# EAGLE board e-ink-display-v020 (EAGLE 9.4.2)
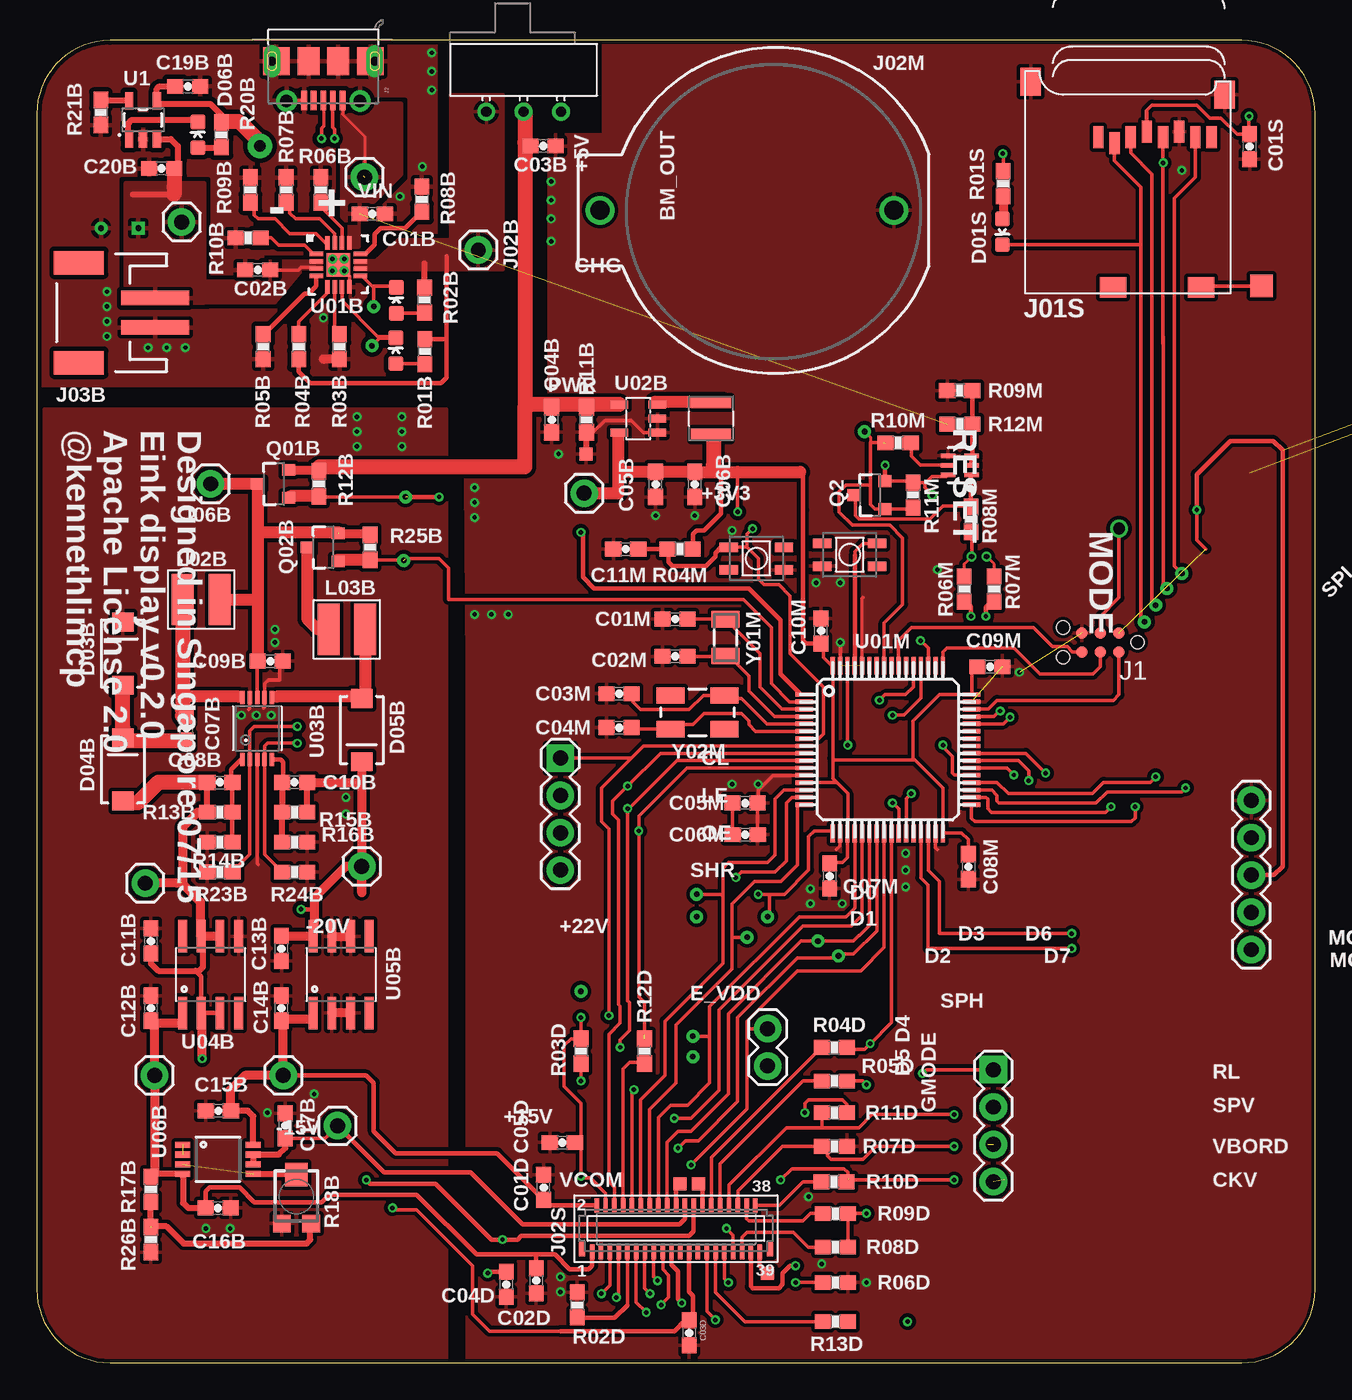
[diagram p5: board, top side]
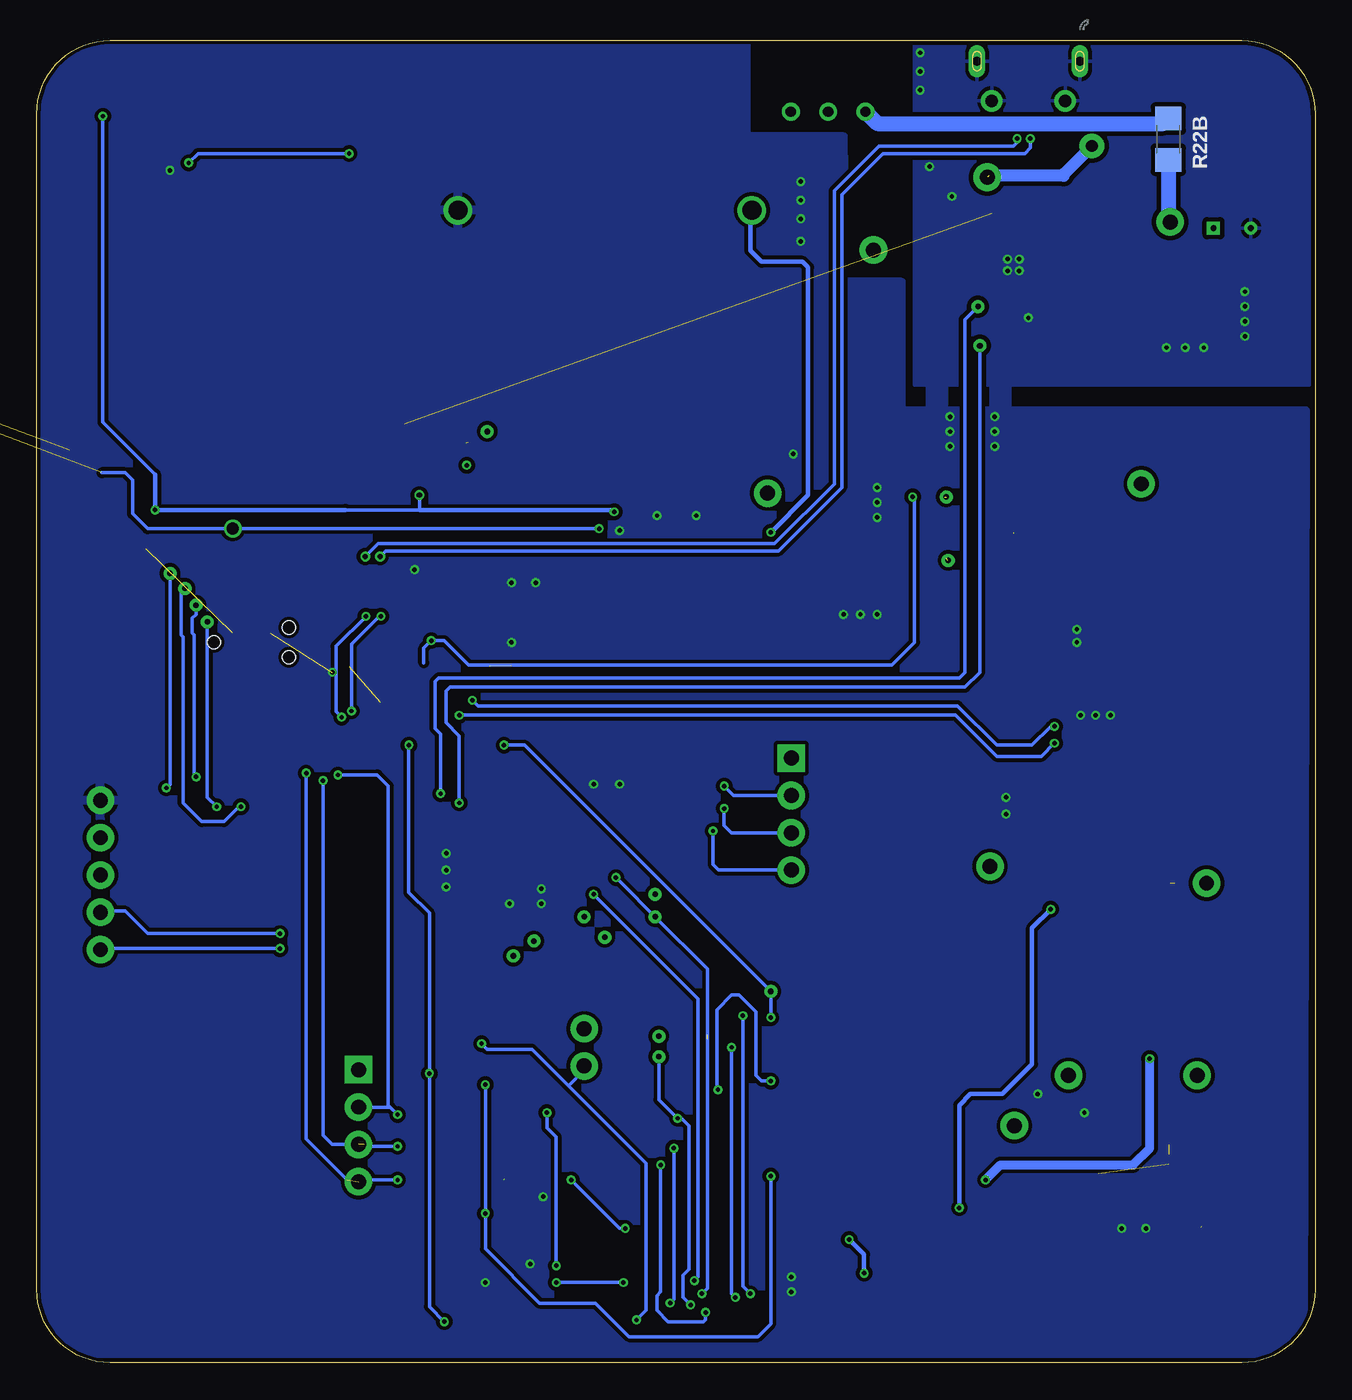
[diagram p6: board, bottom side, seen from below]

Size 87 x 90 mm. Coordinates in mm from the lower left corner, seen from the top.
Outline: 5,0 82,0 arc90 87,5 87,85 arc90 82,90 5,90 arc90 0,85 0,5 arc90 5,0
Copper layers (1*16): Top 0.035mm / dielectric 1.5mm / Bottom 0.035mm
Design rules "dirt_cheap_dirty_boards.v1": minimum track width 5mil, minimum drill 0.3mm, track to track 6mil, track to pad 6mil, pad to pad 6mil, via to via 6mil, smd to smd 0mil, copper to edge 10mil, drill to drill 10mil, minimum pad ring 10mil, minimum via ring 6mil, stop-mask expansion 2mil, vias tented up to drill 25mil, thermal gap 10mil
Net classes: 0 default: width 0.203 mm

## Footprints (pad centres in the part's own frame; a part is rotated, then mirrored left to right if it is on the bottom)
TP-SQ_15TH = drill 0.381 pad 0.61 square: P$1 0,0
TP-RD_15TH = drill 0.381 pad 0.61: P$1 0,0
0603-CAP = smd 1.1 x 1: 1 -0.85,0; 2 0.85,0
LED-0603 = smd 1 x 1: A 0,-0.877; C 0,0.877
SMA-DIODE = smd 1.27 x 1.47: A -2.15,0; C 2.15,0
TC2030-MCP-NL = smd 0.787 x 0.787: 1 1.27,-0.635; 2 1.27,0.635; 3 2.54,-0.635; 4 2.54,0.635; 5 3.81,-0.635; 6 3.81,0.635 | hole 0.889: 0,0; 5.08,-1.016; 5.08,1.016
1X01 = drill 1.016 pad 1.88: 1 0,0
MICROSD = smd 0.7 x 1.5: 1 9,-10.64; 2 7.9,-10.24; 3 6.8,-10.64; 4 5.7,-11.04; 5 4.6,-10.64; 6 3.5,-11.04; 7 2.4,-10.64; 8 1.3,-10.64 | smd 1.8 x 1.4: CD1 2,-0.44; CD2 8,-0.44 | smd 1.4 x 1.9: MT1 0.4,-13.54; MT2 13.6,-14.44
MOLEX_105017-0001 = smd 0.4 x 1.35: 1 -1.3,2.675; 2 -0.65,2.675; 3 0,2.675; 4 0.65,2.675; 5 1.3,2.675 | drill 0.6 pad 0.8 long: MH1 -3.5,0; MH2 3.5,0 | drill 0.85 pad 1.45: MH3 2.5,2.7; MH4 -2.5,2.7 | smd 1.5 x 1.9: P$8 -1,0; P$9 1,0 | smd 1.8 x 1.9: P$10 -3.2,0; P$11 3.2,0
BATTCOM_20MM_PTH = drill 1.3: 1 11.85,0; 2 -8.15,0
FPC-0.3-39 = smd 0.3 x 1: 1 -1.2,-1.45; 2 -0.89,1.7; 3 -0.6,-1.45; 4 -0.29,1.7; 5 0,-1.45; 6 0.31,1.7; 7 0.6,-1.45; 8 0.91,1.7; 9 1.2,-1.45; 10 1.51,1.7; 11 1.8,-1.45; 12 2.11,1.7; 13 2.4,-1.45; 14 2.71,1.7; 15 3,-1.45; 16 3.31,1.7; 17 3.6,-1.45; 18 3.91,1.7; 19 4.2,-1.45; 20 4.51,1.7; 21 4.8,-1.45; 22 5.11,1.7; 23 5.4,-1.45; 24 5.71,1.7; 25 6,-1.45; 26 6.31,1.7; 27 6.6,-1.45; 28 6.91,1.7; 29 7.2,-1.45; 30 7.51,1.7; 31 7.8,-1.45; 32 8.11,1.7; 33 8.4,-1.45; 34 8.71,1.7; 35 9,-1.45; 36 9.31,1.7; 37 9.6,-1.45; 38 9.91,1.7; 39 10.2,-1.45 | smd 0.4 x 1: H1 -1.9,-1.25; H2 10.9,-1.25
JST-2-SMD = smd 1 x 4.6: 1 -1,-3.7; 2 1,-3.7 | smd 1.6 x 3.4: NC1 -3.4,1.5; NC2 3.4,1.5
1X05 = drill 1.016 pad 1.88: 1 0,0; 2 2.54,0; 3 5.08,0; 4 7.62,0; 5 10.16,0
1X04 = drill 1.016 pad 1.88 square: 1 0,0 | drill 1.016 pad 1.88: 2 2.54,0; 3 5.08,0; 4 7.62,0
1X02 = drill 1.016 pad 1.88: 1 0,0; 2 2.54,0
INDUCTOR-NR3015 = smd 0.8 x 2.7: 1 -1.1,0; 2 1.1,0
4040(1515) = smd 1.5 x 3.5: P$1 1.25,0; P$2 -1.25,0
SOT23-3 = smd 0.8 x 0.9: 1 -0.95,-1; 2 0.95,-1; 3 0,1.1
SOT363 = smd 0.3 x 0.99: 1 -0.65,-0.8; 2 0,-0.8; 3 0.65,-0.8; 4 0.65,0.81; 5 0,0.81; 6 -0.65,0.81
0603-RES = smd 1.1 x 1: 1 -0.85,0; 2 0.85,0
TC33X = smd 1.2 x 1.2: 1 -1,-1.825; 3 1,-1.825 | smd 1.5 x 1.6: 2 0,1.5
1206 = smd 1.6 x 1.8: 1 -1.4,0; 2 1.4,0
R0603 = smd 1 x 1.1: 1 -0.85,0; 2 0.85,0
TACTILE_SWITCH_SMD = smd 1.25 x 0.65: 1 -1.875,0.775; 2 1.875,0.775; 3 -1.875,-0.775; 4 1.875,-0.775
SW-SPDT-TH = drill 0.7: 1 0,0; 2 -2.54,0; 3 2.54,0
TP35_BOT = smd 0.889 x 0.889 bottom: P$1 0,0
TP_15TH = drill 0.381 pad 0.61: P$1 0,0
SOT23-5 = smd 0.55 x 1.2: 1 -0.95,-1.3; 2 0,-1.3; 3 0.95,-1.3; 4 0.95,1.3; 5 -0.95,1.3
PVQFN-16 = smd 0.9 x 0.3: 1 -1.5,0.75; 2 -1.5,0.25; 3 -1.5,-0.25; 4 -1.5,-0.75; 9 1.5,-0.75; 10 1.5,-0.25; 11 1.5,0.25; 12 1.5,0.75 | smd 0.3 x 0.9: 5 -0.75,-1.5; 6 -0.25,-1.5; 7 0.25,-1.5; 8 0.75,-1.5; 13 0.75,1.5; 14 0.25,1.5; 15 -0.25,1.5; 16 -0.75,1.5 | smd 1.6 x 1.6: EXP 0,0
TQFP64 = smd 1.2 x 0.3: 1 -5.7,3.75; 2 -5.7,3.25; 3 -5.7,2.75; 4 -5.7,2.25; 5 -5.7,1.75; 6 -5.7,1.25; 7 -5.7,0.75; 8 -5.7,0.25; 9 -5.7,-0.25; 10 -5.7,-0.75; 11 -5.7,-1.25; 12 -5.7,-1.75; 13 -5.7,-2.25; 14 -5.7,-2.75; 15 -5.7,-3.25; 16 -5.7,-3.75; 33 5.7,-3.75; 34 5.7,-3.25; 35 5.7,-2.75; 36 5.7,-2.25; 37 5.7,-1.75; 38 5.7,-1.25; 39 5.7,-0.75; 40 5.7,-0.25; 41 5.7,0.25; 42 5.7,0.75; 43 5.7,1.25; 44 5.7,1.75; 45 5.7,2.25; 46 5.7,2.75; 47 5.7,3.25; 48 5.7,3.75 | smd 0.3 x 1.2: 17 -3.75,-5.7; 18 -3.25,-5.7; 19 -2.75,-5.7; 20 -2.25,-5.7; 21 -1.75,-5.7; 22 -1.25,-5.7; 23 -0.75,-5.7; 24 -0.25,-5.7; 25 0.25,-5.7; 26 0.75,-5.7; 27 1.25,-5.7; 28 1.75,-5.7; 29 2.25,-5.7; 30 2.75,-5.7; 31 3.25,-5.7; 32 3.75,-5.7; 49 3.75,5.7; 50 3.25,5.7; 51 2.75,5.7; 52 2.25,5.7; 53 1.75,5.7; 54 1.25,5.7; 55 0.75,5.7; 56 0.25,5.7; 57 -0.25,5.7; 58 -0.75,5.7; 59 -1.25,5.7; 60 -1.75,5.7; 61 -2.25,5.7; 62 -2.75,5.7; 63 -3.25,5.7; 64 -3.75,5.7
MSOP-10 = smd 0.305 x 0.889: 1 -1,-2.11; 2 -0.5,-2.11; 3 0,-2.11; 4 0.5,-2.11; 5 1,-2.11; 6 1,2.11; 7 0.5,2.11; 8 0,2.11; 9 -0.5,2.11; 10 -1,2.11
SO08 = smd 0.61 x 2.21: 1 -1.905,-2.616; 2 -0.635,-2.616; 3 0.635,-2.616; 4 1.905,-2.616; 5 1.905,2.616; 6 0.635,2.616; 7 -0.635,2.616; 8 -1.905,2.616
MSOP-8 = smd 0.41 x 1.02: 1 -0.975,-2.4; 2 -0.325,-2.4; 3 0.325,-2.4; 4 0.975,-2.4; 5 0.975,2.4; 6 0.325,2.4; 7 -0.325,2.4; 8 -0.975,2.4
TP60_BOT = smd 1.524 x 1.524 bottom: P$1 0,0
FC135 = smd 1.1 x 1.9: X1 -1.25,0; X2 1.25,0
CRYSTAL-SMD-5X3 = smd 1.9 x 1.1: 1 -1.85,-1.15; 2 1.85,-1.15; 3 1.85,1.15; 4 -1.85,1.15

## Placement (x,y rotation side)
BAT+  [TP-SQ_15TH]  6.91,77.22 0 top
BAT-  [TP-RD_15TH]  4.37,77.22 0 top
C01B  1uF, 25V, 10%  [0603-CAP]  22.84,78.19 180 top
C01D  100nF  [0603-CAP]  34.5,11.94 90 top
C01M  10pF, 6.3V, X5R  [0603-CAP]  43.44,50.62 180 top
C01S  0.1uF, 6.3V, X5R  [0603-CAP]  82.54,82.76 270 top
C02B  4.7uF, 25V, X5R  [0603-CAP]  15.04,74.37 0 top
C02D  100nF  [0603-CAP]  33.99,5.59 270 top
C02M  10pF, 6.3V, X5R  [0603-CAP]  43.44,48.08 180 top
C03B  4.7uF, 25V, X5R  [0603-CAP]  34.46,82.8 180 top
C03D  100nF  [0603-CAP]  44.4,2.03 270 top
C03M  22pf, 6.3V, X5R  [0603-CAP]  39.63,45.54 180 top
C04B  4.7uF, 25V, X5R  [0603-CAP]  35.04,64.17 90 top
C04D  100nF  [0603-CAP]  31.96,5.33 270 top
C04M  22pf, 6.3V, X5R  [0603-CAP]  39.63,43.23 180 top
C05B  22uF, 25V, X5R  [0603-CAP]  42.12,59.78 90 top
C05D  100nF  [0603-CAP]  35.77,14.99 180 top
C05M  10nF, 6.3V, X5R  [0603-CAP]  48.21,38.09 0 top
C06B  0.1uF, 25V, X5R  [0603-CAP]  44.78,59.78 90 top
C06M  1.0uF, 6.3V, X5R  [0603-CAP]  48.21,35.94 0 top
C07B  0.1uF, 50V, X5R  [0603-CAP]  10.18,43.18 270 top
C07M  100nF, 6.3V, X5R  [0603-CAP]  53.96,33.12 270 top
C08B  100pf, 50V, X5R  [0603-CAP]  12.47,39.5 180 top
C08M  100nF, 6.3V, X5R  [0603-CAP]  63.4,33.76 270 top
C09B  4.7uF, 50V, X5R  [0603-CAP]  15.89,47.75 180 top
C09M  100nF, 6.3V, X5R  [0603-CAP]  64.87,47.37 0 top
C10B  4.7pf, 50V, X5R  [0603-CAP]  17.55,39.5 0 top
C10M  100nF, 6.3V, X5R  [0603-CAP]  53.38,49.81 90 top
C11B  1uF, 50V, X5R  [0603-CAP]  7.77,28.7 270 top
C11M  100nF, 6.3V, X5R  [0603-CAP]  40.09,55.38 180 top
C12B  0.1uF, 50V, X5R  [0603-CAP]  7.77,24.13 270 top
C13B  1uF, 50V, X5R  [0603-CAP]  16.66,28.19 90 top
C14B  0.1uF, 50V, X5R  [0603-CAP]  16.66,24.13 270 top
C15B  0.1uF, 25V, X5R  [0603-CAP]  12.36,17.14 0 top
C16B  0.1uF, 25V, X5R  [0603-CAP]  12.34,10.54 180 top
C17B  0.1uF, 25V, X5R  [0603-CAP]  16.91,16.13 270 top
C19B  4.7uF (DNP)  [0603-CAP]  10.28,86.87 180 top
C20B  4.7uF (DNP)  [0603-CAP]  8.5,81.28 0 top
D01B  Green  [LED-0603]  24.44,68.87 0 top
D01S  Red  [LED-0603]  65.72,76.98 180 top
D02B  Red  [LED-0603]  24.46,72.3 0 top
D03B  SS24T3G  [SMA-DIODE]  5.86,48.26 90 top
D04B  SS24T3G  [SMA-DIODE]  5.86,40.39 90 top
D05B  SS24T3G  [SMA-DIODE]  22.12,43.05 270 top
D06B  Red (DNP)  [LED-0603]  10.97,83.57 0 top
J1  [TC2030-MCP-NL]  74.93,49.02 180 top
J01B  [1X01]  22.31,80.68 270 top
J01S  MICROSD  [MICROSD]  81.25,72.75 180 top
J2  105017-0001  [MOLEX_105017-0001]  19.51,88.58 180 top
J02B  [1X01]  30.05,75.73 270 top
J02M  [BATTCOM_20MM_PTH]  50.19,78.43 180 top
J02S  EINKED060SC4  [FPC-0.3-39]  39,9 0 top
J03B  [JST-2-SMD]  4.36,71.46 90 top
J04B  [1X01]  9.86,77.63 270 top
J05B  [1X01]  37.26,59.18 0 top
J06B  [1X01]  11.83,59.82 270 top
J07B  [1X01]  7.39,32.64 270 top
J08B  [1X01]  22.12,33.78 270 top
J09B  [1X01]  8.02,19.56 270 top
J10B  [1X01]  16.78,19.56 270 top
J11B  [1X01]  20.47,16.13 0 top
JP2  [1X05]  82.66,38.27 270 top
JP4  [1X04]  35.64,41.15 270 top
JP5  [1X02]  49.74,22.73 270 top
JP6  [1X04]  65.11,19.94 270 top
L01B  2.2uH - NR3015T2R2M  [INDUCTOR-NR3015]  45.89,64.26 270 top
L02B  22uH  [4040(1515)]  11.2,51.94 0 top
L03B  22uH  [4040(1515)]  21.1,49.91 180 top
Q01B  IRLML6402PbF  [SOT23-3]  16.15,59.82 90 top
Q2  IRLML6402PbF (DNP)  [SOT23-3]  56.73,59.05 90 top
Q02B  IRLML6402PbF  [SOT23-3]  19.52,55.49 90 top
Q02M  MMDT3904  [SOT363]  62.83,61.08 90 top
R01B  1K, 1%  [0603-RES]  26.42,68.82 270 top
R01S  1K, 1%  [0603-RES]  65.77,80.25 90 top
R02B  1K, 1%  [0603-RES]  26.4,72.33 90 top
R02D  0 Ohm  [0603-RES]  36.78,3.94 90 top
R03B  0 Ohm  [0603-RES]  20.6,69.15 270 top
R03D  0 Ohm  [0603-RES]  37.04,21.21 270 top
R04B  0 Ohm  [0603-RES]  17.84,69.15 270 top
R04D  0 Ohm  [0603-RES]  54.29,21.46 180 top
R04M  10K, 1%  [0603-RES]  43.77,55.38 0 top
R05B  0 Ohm  [0603-RES]  15.41,69.15 90 top
R05D  0 Ohm  [0603-RES]  54.29,19.18 180 top
R06B  0 ohm (DNP)  [0603-RES]  19.33,79.81 270 top
R06D  0 Ohm  [0603-RES]  54.36,5.46 180 top
R06M  22, 1%  [0603-RES]  63.13,52.65 90 top
R07B  0 Ohm  [0603-RES]  16.98,79.81 270 top
R07D  0 Ohm  [0603-RES]  54.29,14.73 0 top
R07M  22, 1%  [0603-RES]  65.16,52.65 90 top
R08B  2K, 1%  [0603-RES]  26.21,79.18 270 top
R08D  0 Ohm  [0603-RES]  54.36,7.87 180 top
R08M  1K5  [0603-RES]  63.59,57.4 90 top
R09B  1K, 1%  [0603-RES]  14.54,79.81 270 top
R09D  0 Ohm  [0603-RES]  54.36,10.16 180 top
R09M  1K, 1%  [0603-RES]  62.81,66.16 0 top
R10B  10K, 1%  [0603-RES]  14.39,76.55 0 top
R10D  0 Ohm  [0603-RES]  54.26,12.32 0 top
R10M  1K, 1%  [0603-RES]  58.62,62.6 0 top
R11B  100K, 1%  [0603-RES]  37.42,64.17 90 top
R11D  0 Ohm  [0603-RES]  54.29,17.02 180 top
R11M  47K, 1%  [0603-RES]  59.64,59.06 270 top
R12B  10K, 1%  [0603-RES]  19.2,59.82 90 top
R12D  0 Ohm  [0603-RES]  41.36,21.2 90 top
R12M  10K, 1%  [0603-RES]  62.82,63.89 180 top
R13B  470K, 1%  [0603-RES]  12.47,37.47 180 top
R13D  0 Ohm  [0603-RES]  54.36,2.8 180 top
R14B  33K, 1%  [0603-RES]  12.47,35.43 0 top
R15B  560K, 1%  [0603-RES]  17.55,37.47 0 top
R16B  33K, 1%  [0603-RES]  17.55,35.43 180 top
R17B  200K, 1%  [0603-RES]  7.77,11.81 90 top
R18B  100K, 25%  [TC33X]  17.67,11.3 0 top
R20B  1K (DNP)  [0603-RES]  12.56,83.57 270 top
R21B  2K (DNP)  [0603-RES]  4.36,85.09 90 top
R22B  0 ohm (DNP)  [1206]  9.99,83.28 90 bottom
R23B  0 Ohm  [0603-RES]  12.47,33.41 180 top
R24B  0 Ohm  [0603-RES]  17.55,33.39 0 top
R25B  10K, 1%  [0603-RES]  22.69,55.49 90 top
R26B  DNP  [0603-RES]  7.77,8.38 90 top
R112  10K  [R0603]  95.12,65.66 0 top  (outside the outline)
S01M  [TACTILE_SWITCH_SMD]  55.33,54.99 180 top
S02M  [TACTILE_SWITCH_SMD]  48.98,54.74 0 top
SW01M  SWITCHSIDE-SLIDE  [SW-SPDT-TH]  33.14,85.14 0 top
TP1  [TP-RD_15TH]  25.1,58.93 0 top
TP01B  TP1  [TP35_BOT]  37.38,61.85 0 bottom
TP01M  [TP-RD_15TH]  37.04,25.27 0 top
TP1M  [TP-RD_15TH]  48.34,28.96 0 top
TP2  [TP-RD_15TH]  24.97,54.61 0 top
TP02M  [TP-RD_15TH]  76.15,51.56 0 top
TP03M  TEST-POINTTP_15TH_THRU  [TP_15TH]  77.93,53.72 0 top
TP04M  [TP-RD_15TH]  76.92,52.7 0 top
TP05M  [TP-RD_15TH]  75.39,50.42 0 top
TP06M  [TP-RD_15TH]  56.34,63.37 0 top
TP07M  [TP-RD_15TH]  22.81,69.22 0 top
TP08M  [TP-RD_15TH]  22.94,71.88 0 top
TP09M  [TP-RD_15TH]  44.91,31.88 0 top
TP10M  [TP-RD_15TH]  44.91,30.35 0 top
TP12M  [TP-RD_15TH]  49.74,30.35 0 top
TP13M  [TP-RD_15TH]  44.66,22.23 0 top
TP14M  [TP-RD_15TH]  44.66,20.83 0 top
TP15M  [TP-RD_15TH]  53.17,28.7 0 top
TP16M  [TP-RD_15TH]  54.56,27.69 0 top
U1  MCP73831  [SOT23-5]  7.23,84.58 0 top
U01B  BQ24075  [PVQFN-16]  20.53,74.71 0 top
U01M  STM32F10XRXT6  [TQFP64]  57.92,41.73 0 top
U02B  R8008-33  [SOT23-5]  40.94,64.26 90 top
U03B  LT1945-IMS#PBF  [MSOP-10]  15.01,43.18 0 top
U04B  LM79L15  [SO08]  11.83,26.42 0 top
U05B  LM78L15  [SO08]  20.72,26.42 0 top
U06B  LM358-DGKR  [MSOP-8]  12.34,13.84 270 top
U$1  TP1  [TP35_BOT]  43.77,12.19 0 bottom
U$5  TP3  [TP60_BOT]  83.35,73.28 90 bottom
U$8  TP1  [TP35_BOT]  45.04,12.19 0 bottom
U$9  TP1  [TP35_BOT]  49.74,6.1 0 bottom
Y01M  32kHz  [FC135]  46.87,49.35 90 top
Y02M  8MHz  [CRYSTAL-SMD-5X3]  44.97,44.27 0 top

## Tracks (layer width: path | path; a pad name or v marks a point on that pad's centre or on a via)
!RST  (via drill 0.3, 0.8 pad 0.8)  (1 unrouted)
  Top 0.254: U01M.7 53.23,42.48 53.55,42.8 53.55,45.97 51.26,48.26 51.26,52.2 50.5,52.96 49.48,52.96 49.1,53.34 49.1,54.74 48.34,55.5 | 48.34,55.5 47.11,55.5 S02M.1 | 48.34,55.5 48.34,56.39 v48.72,56.77 | J1.3 72.39,50.8 73.66,52.07 v73.66,56.77
  Top 0.305: S02M.1 46.58,55.51 46.18,55.12 46.18,54.86 45.55,54.23 43.26,54.23 43.01,54.48 43.01,55.3 R04M.1 C11M.1 40.81,55.38
  Bottom 0.254: v48.72,56.77 v73.66,56.77 79.46,56.77 80.47,57.78 80.47,60.07 80.98,60.58 82.57,60.58
+3V3  (via drill 0.3, 0.35 pad 0.65)  (2 unrouted)
  Top 0.254: C10M.1 53.55,48.78 53.55,48.01 54.13,47.43 U01M.64 54.17,41.15 | U01M.13 54.46,39.48 | 54.46,39.48 55.2,38.73 55.2,36.05 U01M.19 55.17,34.39 54.82,34.04 54.02,34.04 C07M.1 54.02,34.04 | C08M.1 63.4,35.61 62.95,36.07 61.71,36.07 U01M.32 61.67,39.12 59.77,41.02 | C09M.1 63.63,46.98 63.63,45.47 U01M.48 61.43,45.48 59.64,43.69 59.64,41.15 59.77,41.02 | Q2.2 59.55,60 R11M.1 60.45,59.91 | 60.45,59.91 60.5,59.91 60.91,60.33 61.91,60.33 Q02M.6 | 54.17,41.15 54.17,39.76 54.46,39.48 | 54.17,41.15 54.3,41.02 59.77,41.02 | C01S.1 82.42,83.61 | 75.55,85.25 75.52,85.22 75.52,83.83 J01S.4 75.55,85.25 | 79.56,55.39 78.95,56.01 v78.95,58.04 | v47.71,57.91 47.71,60.63 | 75.55,85.25 75.9,85.6 78.95,85.6 79.84,84.71 80.6,84.71 81.69,83.61 82.42,83.61 | 82.42,83.61 82.5,83.69 v82.5,84.84 | 46.56,60.58 46.05,60.58 46.05,60.63 | v60.96,59.05 60.45,59.56 60.45,59.91
  Top 0.305: C10M.1 52.34,48.96 52.15,49.15 52.15,58.04 52.15,60.45 51.97,60.63 | 39.58,63.12 39.64,63.12 U02B.5 | 46.05,63 45.89,63 L01B.2 | v57.74,61.09 57.73,61.08 Q2.2 | JP2.3 84.2,33.19 84.79,33.78 84.79,62.1 84.16,62.74 81.23,62.74 78.95,60.45 v78.95,58.04 | 46.56,60.58 46.56,57.78 45.42,56.64 44.91,56.64 44.66,56.39 44.66,55.41 R04M.2
  Top 0.406: 46.05,60.63 46.05,61.09 | 46.82,60.63 46.56,60.63 46.56,60.58
  Top 0.813: 39.58,60.63 C05B.2 C06B.2 46.05,60.63 46.82,60.63 47.71,60.63 51.97,60.63 | 39.58,60.63 39.58,63.12 | J05B.1 39.58,59.18 39.58,60.63
  Top 1.016: 46.05,63 46.05,61.09
  Bottom 0.254: 47.83,58.04 v47.71,57.91 | v82.5,84.84 82.5,64.01 78.95,60.45 | 65.99,58.04 60.96,58.04 v60.96,59.05
  Bottom 0.305: 60.96,58.04 47.83,58.04 | 65.99,58.04 v78.95,58.04 78.95,60.45
+15V
  Top 0.254: C01D.1 34.5,10.7
  Top 0.305: J02S.2 34.5,10.7 | C01D.1 31.33,14.26 24.43,14.26 22.94,15.75 22.94,19.05 22.43,19.56 J10B.1
  Top 0.406: U06B.8 14.74,16.78 14.37,17.14 C15B.2
  Top 0.61: U05B.1 18.82,23.5 18.69,23.37 16.75,23.37 C14B.2 16.78,23.28 J10B.1 14.18,19.56 13.16,18.54 13.16,17.2 C15B.2
+22V  (via drill 0.3)
  Top 0.254: 24.34,10.67 v24.21,10.54 24.34,10.41 25.86,10.41 29.67,6.6 29.67,3.3 30.82,2.16 35.64,2.16
  Top 0.305: J02S.23 44.4,4.83 44.66,4.57 44.66,3.14 C03D.1 44.11,2.88 43.39,2.16 35.64,2.16 | v17.99,30.86 18.88,30.86 | 18.88,29.72 18.88,29.09 U05B.8
  Top 0.406: R15B.2 C10B.2
  Top 0.61: D05B.C 22.12,39.5 | 22.12,39.5 22.12,38.86 22.12,32 J08B.1 21.04,33.78 18.88,31.62 18.88,30.86 18.88,29.72 | C10B.2 22.12,39.5 | C13B.2 18.8,29.04 U05B.8
  Bottom 0.305: v24.21,10.54 24.21,17.53 23.45,18.29 21.29,18.29 19.26,20.32 19.26,29.59 v17.99,30.86
-15V
  Top 0.305: 9.8,23.11 9.8,23.67 U04B.1 | J02S.1 37.8,6.6 37.55,6.35 36.28,6.35 35.26,7.37 33.99,7.37 | C16B.2 11.51,10.56 11.51,11.68 11.77,11.94 13.8,11.94 14.81,10.92 19.39,10.92 19.89,11.43 25.86,11.43 29.93,7.37 33.99,7.37 | 33.99,7.37 C02D.1
  Top 0.406: C16B.2 10.31,10.54 9.96,10.88 9.96,12.61 9.94,12.64 U06B.4 7.97,12.87 R17B.2
  Top 0.61: 9.8,23.11 7.77,23.11 C12B.2 8.02,23.28 J09B.1 8.02,12.91 R17B.2
-20V  (via drill 0.3)  (1 unrouted)
  Top 0.305: U04B.3 U04B.2 | U04B.2 11.2,26.29 10.81,26.67 | J02S.24 44.71,8.94 44.4,8.64 32.97,8.64 32.72,8.38 v31.7,8.38 30.94,8.38 27.13,12.19 22.69,12.19 v22.43,12.45 | 11.26,23.73 U04B.2 | C04D.1 30.78,6.18 v30.69,6.1
  Top 0.406: R13B.2 C08B.2 | C11B.2 7.77,27.18 8.28,26.67 10.81,26.67 11.07,26.67 11.32,26.92 11.32,28.91 U04B.7
  Top 0.61: U04B.6 U04B.7 11.13,29.1 11.13,31.37 9.86,32.64 9.93,32.64 9.93,36.45 10.94,37.47 R13B.2 | 9.54,32.64 J07B.1 | v11.26,20.7 11.26,23.73
  Top 1.016: C08B.2 8.28,39.5 6.88,38.1 6,38.1 D04B.A
  Bottom 0.305: v30.69,6.1 30.69,7.37 v31.7,8.38
  Bottom 0.61: v22.43,12.45 21.42,13.46 12.4,13.46 11.26,14.61 v11.26,20.7
BM_BAT
  Top 0.254: C02B.2 17.81,74.37 17.99,74.55 18.94,74.55 U01B.3
  Top 0.406: 9.35,79.5 6.56,79.5 | U1.3 9.13,83.28 9.61,82.8 9.61,81.54 C20B.2
  Top 1.016: C20B.2 9.35,80.01 9.35,79.5
  Bottom 1.016: 9.95,77.8 J04B.1 9.99,77.76 R22B.1
  pour Top (isolate 0.254): 17.91,74.98 15.5,74.98 15.47,73.61 6.02,73.63 6.02,72.14 16.21,72.14 17.91,74.19
  pour Top (no thermals): 19.36,74.98 17.96,74.98 17.96,74.45 19.36,74.45
  pour Top: 11.38,72.14 6.05,72.14 6.05,80.26 11.38,80.26
BM_CE
  Top 0.254: U01B.4 19,73.94
  Top 0.305: R05B.2 15.47,70 18.24,72.77 18.5,72.77 19,73.28 19,73.94
BM_CHG  (via drill 0.3)
  Top 0.254: U01B.9 22.13,73.96 22.81,73.28 23.07,73.28 | 23.07,73.28 24.36,73.28 D02B.C | TP08M.P$1 22.94,73.15 23.07,73.28 | U01M.27 59.17,38.39 v59.52,38.73
  Bottom 0.254: TP08M.P$1 23.83,70.99 23.83,46.99 24.21,46.61 59.64,46.61 59.9,46.35 59.9,43.18 59.52,42.8 v59.52,38.73
BM_OUT
  Top 0.305: 27.89,69.67 27.89,67.06 27.51,66.67 18.62,66.67 17.84,67.46 R04B.2 | 27.89,69.67 27.89,75.31 | 27.89,69.67 R01B.1
  Top 0.406: R02B.2 26.39,74.78 26.37,74.8
  Bottom 1.016: 9.99,84.96 R22B.2 10.33,84.33 29.79,84.33 SW01M.2
  pour Top (isolate 0.254): 28.16,86.3 31.73,86.3 31.73,74.4 23,74.4 23,74.95 24.6,76.45 28.16,76.45
  pour Top (no thermals): 21.7,75 23.1,75 23.1,74.4 21.7,74.4
BM_PGOOD  (via drill 0.3)
  Top 0.254: U01B.7 20.78,72.27 23.2,69.85 24.34,69.85 D01B.C 23.35,69.75 TP07M.P$1 | U01M.26 58.67,37.67 v58.25,38.1
  Bottom 0.254: v58.25,38.1 58.25,42.67 59.14,43.56 59.14,45.72 58.88,45.97 23.83,45.97 22.81,46.99 TP07M.P$1
BM_SUPPLY
  Top 0.254: C03B.2 33.48,82.8 33.23,83.06
  Top 0.305: 39.71,65.28 U02B.4 | C04B.2 34.37,65.02 34.37,65.21 | R11B.2 36.66,65.02 36.66,65.21
  Top 0.61: Q01B.2 19.1,60.77 R12B.2
  Top 1.016: U02B.4 36.66,65.21 34.37,65.21 33.42,65.21 33.23,65.02 | SW01M.1 33.23,85.26 33.23,83.06 33.23,65.02 | 33.23,65.02 33.23,60.96 19.24,60.96 R12B.2
BM_SYSOFF
  Top 0.254: U01B.15 20.28,76.83 19.26,77.85 17.61,77.85 17.23,78.23 17.23,78.72 R07B.2
CE2  (via drill 0.3)
  Top 0.254: v37.04,19.18 R03D.2 | J02S.10 40.51,18.46 v40.64,18.59
  Bottom 0.254: 40.51,18.46 v40.64,18.59 40.72,18.67 40.72,24 39.7,25.02 39.2,25.02 38.05,23.88 38.05,19.56 37.67,19.18 v37.04,19.18
D+_CTRL
  Top 0.254: Q2.3 55.71,58.97 55.71,57.66 55.96,57.4 60.79,57.4 61.68,58.3 63.54,58.3 R08M.2
  Top 0.305: R08M.2 63.59,60.39 Q02M.1
EINK_CKV  (via drill 0.3)  (2 unrouted)
  Top 0.254: U01M.40 67.32,41.48 v68.66,40.13 | J02S.33 47.4,8.69 v46.94,9.14 | v50.63,12.45 51.39,13.21 54.95,13.21 55.2,12.95 55.2,12.53 | v62.44,12.45 55.24,12.45 R10D.2
  Bottom 0.254: v68.66,40.13 68.66,15.24 65.87,12.45 v62.44,12.45 | v46.94,9.14 47.33,9.14 v50.63,12.45
EINK_CL  (via drill 0.3)
  Top 0.254: U01M.8 41.3,41.98 40.47,41.15 | J02S.5 39,5.26 v38.44,4.7 | v38.94,23.62 38.94,36.32 38.44,36.83 38.44,39.12 40.47,41.15 | JP4.1 40.47,41.15
  Bottom 0.254: v38.94,23.62 38.94,5.21 v38.44,4.7
EINK_D0
  Top 0.254: U01M.14 50.87,38.98 50.25,38.35 50.25,34.54 49.74,34.04 47.07,34.04 46.69,33.66 46.69,31.75 | 46.69,31.75 46.69,27.18 42.75,23.24 42.75,19.56 41.1,17.91 J02S.12 | TP09M.P$1 46.56,31.88 46.69,31.75
EINK_D1  (via drill 0.3)
  Top 0.254: U01M.15 51.38,38.48 51.01,38.1 51.01,34.16 50.25,33.4 47.96,33.4 v47.58,33.02 | v41.74,4.7 41.36,5.08 41.36,7.51 J02S.13
  Bottom 0.254: v47.58,33.02 47.2,32.64 TP10M.P$1 41.36,26.8 41.36,5.08 v41.74,4.7
EINK_D2
  Top 0.254: J02S.14 41.71,17.25 43.52,19.05 43.52,22.99 47.33,26.8 47.33,28.96 | 47.33,28.96 47.33,31.24 48.85,32.77 50.64,32.77 51.77,33.89 51.77,37.97 51.77,37.98 U01M.16 | TP1M.P$1 47.33,28.96
EINK_D3  (via drill 0.3)
  Top 0.254: 49.87,31.88 50.88,31.88 52.53,33.53 52.53,35.81 52.91,36.2 54,36.2 U01M.17 | v42.24,5.59 41.99,5.84 J02S.15 | v49.1,31.88 49.87,31.88 | 49.87,31.88 49.87,30.48 TP12M.P$1
  Bottom 0.254: v49.1,31.88 41.99,24.77 41.99,5.84 v42.24,5.59
EINK_D4
  Top 0.254: U01M.20 55.67,30.95 55.07,30.35 51.9,30.35 45.8,24.26 45.8,22.35 45.8,22.23 | J02S.16 42.31,16.7 43.13,17.53 44.28,17.53 45.8,19.05 45.8,22.23 | TP13M.P$1 45.8,22.23
EINK_D5  (via drill 0.3)
  Top 0.254: v43.39,16.64 44.53,16.64 46.44,18.54 46.44,24 52.15,29.72 55.45,29.72 56.17,30.44 U01M.21 | v42.5,3.94 43.01,4.45 43.01,5.97 42.63,6.35 42.63,7.52 J02S.17
  Bottom 0.254: v42.5,3.94 43.01,4.45 43.01,5.97 42.63,6.35 42.63,16.13 43.13,16.64 v43.39,16.64 44.66,17.91 | 44.66,17.91 TP14M.P$1 44.66,17.91
EINK_D6
  Top 0.254: J02S.18 42.91,15.02 43.64,15.75 44.53,15.75 47.07,18.29 47.07,23.75 52.02,28.7 TP15M.P$1 | U01M.22 56.67,29.77 55.99,29.08 55.96,29.08 55.58,28.7 | 55.58,28.7 TP15M.P$1 | 55.58,28.7 TP15M.P$1
EINK_D7  (via drill 0.3)
  Top 0.254: U01M.23 57.17,29.41 55.58,27.81 54.69,27.81 TP16M.P$1 54.44,27.56 51.77,27.56 47.71,23.5 47.71,17.78 45.04,15.11 44.15,15.11 v43.64,14.61
  Top 0.305: v43.9,4.06 43.64,4.32 43.64,6.22 43.2,6.67 J02S.19
  Bottom 0.254: v43.64,14.61 43.64,4.32 v43.9,4.06
EINK_GMODE2  (via drill 0.3)
  Top 0.254: U01M.25 58.17,23.17 v56.72,21.72 56.34,21.34 55.26,21.34 R04D.1 | J02S.27 45.6,3.5 v46.18,2.92
  Bottom 0.254: v46.18,2.92 45.55,3.56 45.55,13.59 50.82,18.86 | 50.82,18.86 53.29,21.34 56.34,21.34 v56.72,21.72 56.79,21.78 | JP5.2 49.74,19.94 50.82,18.86
EINK_LE  (via drill 0.3)
  Top 0.254: U01M.9 42.45,41.48 v40.21,39.24 39.2,38.23 39.2,37.34 39.58,36.96 39.58,24.38 39.7,24.26 39.7,23.11 38.94,22.35 38.94,12.32 39.31,11.95 J02S.6
  Bottom 0.254: v40.21,39.24 39.58,38.61 JP4.2
EINK_OE  (via drill 0.3)
  Top 0.254: U01M.10 43.56,40.98 40.3,37.72 v40.21,37.72 40.21,24.64 40.34,24.51 40.34,22.61 39.7,21.97 v39.7,21.46 | J02S.7 39.58,7.53 39.58,4.57 v39.45,4.45 39.45,4.57
  Bottom 0.254: v39.7,21.46 39.7,4.7 v39.45,4.45 | v40.21,37.72 40.21,36.58 39.7,36.07 JP4.3
EINK_RL  (via drill 0.3)
  Top 0.254: 63.65,40.01 U01M.37 63.59,40.01 62.44,40.01 62.31,40.13 62.31,41.27 61.68,41.91 v61.68,42.04 | JP6.1 60.53,19.94 v60.28,19.68
  Bottom 0.254: v61.68,42.04 61.68,32 60.28,30.61 v60.28,19.68 60.28,3.82 v59.26,2.8
EINK_SHR  (via drill 0.3)  (1 unrouted)
  Top 0.254: U01M.11 44.24,40.48 40.98,37.21 v40.98,36.2 40.98,24.89 41.36,24.51 41.36,22.3
  Bottom 0.254: v40.98,36.2 40.98,33.91 40.59,33.53 JP4.4
EINK_SPH  (via drill 0.3)
  Top 0.254: U01M.24 57.67,28.25 56.09,26.67 51.77,26.67 48.34,23.24 48.34,22.61 | 48.34,22.61 48.34,17.27 v44.53,13.46 | J02S.11 40.8,4.11 v41.48,3.43 | JP5.1 48.47,22.73 48.34,22.61
  Bottom 0.254: v44.53,13.46 44.53,4.83 44.78,4.57 44.78,3.56 44.02,2.79 41.61,2.79 41.48,2.92 v41.48,3.43 41.61,3.56
EINK_SPV  (via drill 0.3)
  Top 0.254: J02S.32 47.11,12.1 51.01,16 53.59,16 | U01M.38 66.03,40.48 v66.5,40.01 | v62.44,16.89 56.85,16.89 55.96,16 54.1,16 | 54.1,16 53.83,16 | 53.59,16 54.1,16 | 53.59,16 53.44,16 R11D.2
  Bottom 0.254: v66.5,40.01 63.84,40.01 63.07,39.24 63.07,17.53 62.95,17.4 | JP6.2 62.95,17.4 | 62.95,17.4 v62.44,16.89
EINK_VBORDER  (via drill 0.3)  (1 unrouted)
  Top 0.254: J02S.34 47.71,11.69 50.75,14.73 R07D.1 | U01M.39 66.8,40.98 67.52,40.26 v67.52,39.62 | v62.44,14.73 57.1,14.73 56.22,13.84 54.06,13.84 53.8,14.1 53.8,14.37 R07D.1 | 53.42,14.72 R07D.1
  Bottom 0.254: v67.52,39.62 67.52,15.49 66.88,14.86 64.72,14.86 64.6,14.73 v62.44,14.73
EINK_VDD  (via drill 0.3)
  Top 0.254: R09D.1 R08D.1 55.2,7.87 55.2,10.16 v56.47,10.16 | R05D.1 56.22,19.18 v56.47,18.92 | J02S.4 38.71,11.54 37.67,12.57 37.16,12.57 v37.04,12.7 37.04,14.99 37.04,17.65 35.9,18.8 35.9,21.59 36.36,22.06 R03D.1 v37.04,23.5 | U01M.62 55.17,42.06 v55.2,42.04
  Top 0.305: C05D.1 37.04,14.99
  Bottom 0.254: v56.47,18.92 v56.47,10.16 56.47,7.75 52.79,4.06 48.98,4.06 46.69,1.78 37.93,1.78 37.04,2.67 v37.04,12.7 | v55.2,42.04 53.8,42.04 TP01M.P$1 v37.04,23.5
FB2
  Top 0.305: U03B.5 16.61,41.07 16.78,40.89 16.78,39.59 C10B.1
  Top 0.406: C10B.1 R15B.1 R16B.2
GND  (via drill 0.3, 0.3 pad 0.61)  (3 unrouted)
  Top 0.203: J2.5 18.18,85.88 J2.MH3
  Top 0.254: 16.53,47.54 16.53,46.48 15.77,46.48 15.51,46.22 U03B.7 15.51,44.63 15.45,44.58 | U01B.8 21.28,73.96 v20.93,74.31 | U01M.12 50.09,39.98 49.1,38.99 49.1,38.14 C05M.2 C06M.2 | v54.69,49.02 54.69,47.45 U01M.63 | U03B.9 14.51,44.52 14.43,44.45 | U03B.3 15.01,33.97 15.07,33.91 | U01M.18 54.67,35.16 54.44,34.92 | U01M.31 61.17,35.05 61.3,34.92 | U01M.60 56.17,52.03 56.22,52.07 | U02B.1 41.29,63.31 40.47,64.14 38.69,64.14 37.88,63.32 R11B.1
  Top 0.305: 16.53,47.54 C09B.1
  Top 0.406: R11B.1 37.38,63.32 TP01B.P$1
  Top 0.61: U05B.3 U05B.2 | U05B.7 U05B.6 | R03B.2 19.54,68.3 19.51,68.33
  other vias: 20.93,75.11 20.13,74.31 20.13,75.11 19.51,71.12 35.01,80.39 35.01,79.12 35.01,77.85 35.01,76.33 47.33,56.64 35.51,61.85 44.78,57.66 29.8,50.93 30.94,50.93 32.09,50.93 15.96,44.07 14.94,44.07 13.92,44.07 16.21,49.02 16.21,49.91 54.82,31.24 52.66,31.24 52.66,32.26 47.33,39.37 49.1,39.37 66.88,46.99 21.04,38.48 21.04,37.34 13.16,9.14 11.51,9.14 15.7,17.02 18.88,18.29 56.47,5.46 53.42,6.73 52.53,11.3 59.14,34.67 59.14,33.53 35.64,4.83 35.64,5.84 53.04,53.09 54.69,53.09 77.93,81.15 42.12,57.66 26.24,81.41 24.72,79.38 7.57,69.09 8.84,69.09 10.11,69.09 26.88,89.15 26.88,87.88 26.88,86.61 4.78,72.9 4.78,71.88 4.78,69.85 4.78,70.87 24.85,63.37 24.85,64.39 24.85,62.36 21.8,64.39 21.8,63.37 21.8,62.36 29.8,59.56 29.8,58.55 29.8,57.53 59.14,32.38 61.3,53.98
  pour Top (isolate 0.305, rank 2): 27.13,90.17 27.13,66.55 0.25,66.55 0.25,90.17
  pour Bottom (isolate 0.305): 0.38,89.79 27.26,89.79 27.26,66.55 0.38,66.55
  pour Bottom (isolate 0.254): 28.15,73.53 31.96,73.53 32.09,83.44 38.69,83.44 38.69,89.92 86.95,89.79 87.08,0.64 0.76,0.64 0.64,64.77 28.15,64.77
  pour Bottom (rank 2, no thermals): 20.78,66.55 22.05,66.55 22.05,64.77 20.78,64.77
  pour Top (isolate 0.254): 0.51,64.9 27.89,64.9 27.89,0.25 0.51,0.25
  pour Top (isolate 0.254): 34.88,83.57 34.88,64.26 29.16,64.39 29.29,47.37 29.29,0.13 86.95,0.13 86.95,89.92 38.56,89.79 38.56,83.57
  pour Bottom (rank 2, no thermals): 25.1,66.55 26.37,66.55 26.37,64.77 25.1,64.77
MCU_RX3  (via drill 0.3)
  Top 0.254: U01M.30 60.67,33.52 61.42,32.77 61.42,29.21 v70.44,29.21
  Bottom 0.254: v70.44,29.21 79.46,29.21 80.98,30.73 82.58,30.73 JP2.4
MCU_TX3  (via drill 0.3)
  Top 0.254: U01M.29 60.17,33 60.66,32.51 60.66,28.19 v70.44,28.19
  Bottom 0.254: v70.44,28.19 82.58,28.19 JP2.5
MCU_USB__R_P  (via drill 0.3, 0.35 pad 0.65)
  Top 0.203: J2.3 19.51,84.15 | R06M.2 63.13,54.36 v63.63,54.86
  Top 0.254: R08M.1 63.63,56.5 v63.63,54.86 | 19.51,84.15 19.39,84.02 v19.39,83.31
  Bottom 0.254: v19.39,83.31 19.39,82.68 19.77,82.3 29.42,82.3 32.21,79.5 32.21,59.56 36.53,55.24 63.25,55.24 v63.63,54.86
MCU_USB_N  (via drill 0.3)
  Top 0.254: U01M.44 65.78,43.48 v66.25,43.94
  Top 0.305: R07M.1 64.97,51.8 64.6,51.44 v64.6,50.8
  Bottom 0.254: v64.6,50.8 66.63,48.77 66.63,44.32 v66.25,43.94
MCU_USB_P  (via drill 0.3)
  Top 0.254: v65.58,44.36 65.53,44.36 65.15,43.98 U01M.45
  Top 0.305: v63.58,50.8 63.58,51.48 63.25,51.8 R06M.1
  Bottom 0.254: v65.58,44.36 65.58,48.93 63.71,50.8 v63.58,50.8
MCU_USB_R_N  (via drill 0.3, 0.35 pad 0.65)
  Top 0.203: J2.2 20.16,85.41 20.15,85.4 | R07M.2 65.16,54.35 v64.64,54.86
  Top 0.254: v20.27,83.31 20.27,83.95 20.15,84.07 20.15,85.4
  Bottom 0.254: v20.27,83.31 20.27,83.06 20.53,82.8 29.67,82.8 32.72,79.76 32.72,59.82 36.78,55.75 63.75,55.75 v64.64,54.86
MCU_VBAT  (via drill 0.3)
  Top 0.254: U01M.1 52.01,45.48
  Top 0.305: 52.01,45.48 50.63,46.86 50.63,50.55 48.47,52.7 37.93,52.7 37.16,53.47 37.16,56.39 v37.04,56.52
  Bottom 0.305: v37.04,56.52 34.5,59.05 34.5,74.55 34.88,74.93 37.67,74.93 38.44,75.69 38.44,77.25 38.44,78.33 J02M.1
MODE_BUT
  Top 0.254: 55.67,54.96 55.67,55.21 56.22,55.75 57.19,55.75 S01M.3
  Top 0.305: U01M.61 55.67,54.96
N$1
  Top 0.254: J02S.28 45.93,10.72 45.93,13.97 53.04,21.08 53.05,21.08 R04D.2
N$2
  Top 0.254: 13.88,45.42 U03B.10
  Top 0.305: 9.93,51.18 9.93,51.92 L02B.P$2 | 13.75,45.34 13.96,45.34 U03B.10 | 10.05,45.34 arc90 9.93,45.21 9.93,44.45
  Top 0.813: 10.24,44.09 C07B.1 | 13.75,45.34 10.05,45.34
  Top 1.016: 9.93,51.18 9.93,44.45 9.93,44.03 C07B.1
N$3
  Top 0.61: D04B.C 5.86,43.18
  Top 1.016: 5.86,43.18 D03B.A | C07B.2 6.07,42.33 D04B.C
N$4
  Top 0.305: U01B.12 22.36,75.46 23,76.1 23,76.8 23.4,77.2 25.08,77.2 R08B.2
N$5  (via drill 0.3)
  Top 0.254: R06D.2 v51.64,5.46 | v47.07,5.46 46.82,5.71 46.82,7.53 J02S.31
  Bottom 0.254: v51.64,5.46 v47.07,5.46
N$6  (1 unrouted)
  Top 0.406: U06B.5 17.35,12.87 R18B.2
N$8
  Top 0.254: U03B.6 16.29,45.29 16.34,45.34
  Top 0.61: D05B.A 21.93,45.08 21.67,45.34
  Top 0.813: L03B.P$2 22.35,45.31 D05B.A | 21.67,45.34 16.34,45.34
N$9
  Top 0.254: U01B.16 19.63,76.21 19,76.83 17.23,76.83 16.21,77.85 15.07,77.85 14.81,78.11 14.81,78.7 R09B.2
N$11
  Top 0.254: R04B.1 17.84,70.84 19.78,72.78 U01B.5
N$12
  Top 0.254: U01B.6 20.28,70.18 R03B.1
N$13
  Top 0.254: U01B.14 20.78,77.22 19.64,78.36 19.64,78.66 R06B.2
N$15
  Top 0.254: U01B.1 18.85,75.46 18.24,76.07 16.46,76.07 15.96,76.58 15.27,76.58 R10B.2
N$17
  Top 0.254: D02B.A 26.34,71.42 R02B.1
N$18
  Top 0.254: D01B.A 26.4,67.99 R01B.2
N$19
  Top 0.406: 6.28,85.95 U1.5 6.22,85.94 R21B.2
N$20  (1 unrouted)
N$22
  Top 0.305: Q02M.2 Q02M.3 63.66,61.77 R12M.1 | R09M.2 R12M.1 | R12M.1
N$23
  Top 0.254: L01B.1 46.52,65.36 46.56,65.41
  Top 0.305: 42.39,65.36 42.24,65.36 U02B.3
  Top 0.813: 42.39,65.36 42.05,65.41 46.56,65.41 46.69,65.41
N$24
  Top 0.254: R13D.2 48.21,2.8 46.2,4.81 J02S.29
N$25
  Top 0.813: Q02B.3 18.42,50.62 19.13,49.91 L03B.P$1
N$26
  Top 0.254: J02S.35 48,8.55 48.34,8.89 51.52,8.89 52.53,7.87 R08D.2
N$27
  Top 0.254: J02S.36 48.31,9.81 48.47,9.65 52.15,9.65 52.66,10.16 R09D.2
N$28
  Top 0.254: J02S.9 40.2,3.92
  Top 0.305: 40.2,3.92 39.32,3.05 36.82,3.05 R02D.1
N$29
  Top 0.305: J02S.20 43.51,11.93 U$1.P$1
N$30
  Top 0.254: U1.1 6.21,83.28 | 10.83,84.58 D06B.C
  Top 0.406: 6.21,83.35 U1.1 | 6.21,83.28 6.21,84.33 6.47,84.58 10.83,84.58
N$31
  Top 0.305: J02S.26 45.31,11.92 U$8.P$1
N$32
  Top 0.254: 41.24,20.33 R12D.1 41.33,20.45 40.34,20.45 39.91,20.02 J02S.8
N$33
  Top 0.305: J02S.39 49.2,6.63 U$9.P$1
N$35
  Top 0.254: Q02M.5 60.16,61.08 59.52,61.72 59.52,62.56 R10M.2
N$36  (1 unrouted)
  Top 0.254: 7.63,11.09 R17B.1
  Top 0.406: 7.77,10.6 R17B.1 7.75,10.94 7.75,9.27 8.84,9.27 9.99,8.13 18.37,8.13 18.62,8.38 18.62,9.43 R18B.3
N$37
  Top 0.406: D06B.A 12.54,82.69 R20B.2
NEG_EN  (via drill 0.3)
  Top 0.254: v17.73,43.31 14.81,43.31 14.51,43 U03B.2 14.51,34.6 R23B.1 | U01M.53 59.67,46 59.14,45.47 57.74,45.47 v57.36,45.09
  Bottom 0.254: v17.73,43.31 17.99,43.31 19.26,42.04 21.67,42.04 24.34,44.7 56.98,44.7 v57.36,45.09
NFB1
  Top 0.305: U03B.1 13.91,41.07 13.23,40.39 13.23,39.84 C08B.1 R13B.1 R14B.2
OSC32_IN
  Top 0.254: C01M.1 46.85,50.62 Y01M.X2 47.18,50.29 47.45,50.29 47.45,50.04 49.23,48.26 49.23,45.97 50.73,44.48 U01M.3
OSC32_OUT
  Top 0.254: U01M.4 50.21,43.98 48.47,45.72 48.47,46.74 47.45,47.75 47.22,47.75 Y01M.X1 46.85,48.08 C02M.1
OSC_IN
  Top 0.254: 46.91,45.51 Y02M.3 | U01M.5 49.7,43.48 47.96,45.21 47.02,45.21 Y02M.3 | Y02M.3 45.37,45.42 44.4,44.45 41.1,44.45 40.59,44.96 40.59,45.42 C03M.1
OSC_OUT
  Top 0.254: U01M.6 48.92,42.98 48.47,43.43 48.47,43.69 47.96,44.2 45.42,44.2 44.66,43.43 43.9,43.43 43.58,43.12 Y02M.1 40.59,43.12 C04M.1
POS_CTRL  (2 unrouted)
  Top 0.254: U01M.2 51.24,44.98 49.99,46.23 49.99,50.04 48.09,51.94 28.02,51.94 28.02,54.1 27.39,54.74 25.1,54.74 | R25B.1 25.01,54.64
  Top 0.813: R25B.1 20.49,54.64 Q02B.1
POS_EN  (via drill 0.3)
  Top 0.254: v17.73,42.16 15.7,42.16 15.51,41.97 U03B.4 15.51,34.58 R24B.1 | U01M.52 60.17,45.23 59.01,44.07 v58.25,44.07
  Bottom 0.254: v58.25,44.07 24.46,44.07 21.67,41.27 18.62,41.27 v17.73,42.16
R01S
  Top 0.61: R01S.1 65.77,77.91 D01S.A
SD_CD
  Top 0.254: U$5.P$1 79.34,73.28 J01S.CD1
SD_CS  (via drill 0.3)
  Top 0.254: J01S.2 73.35,81.8 75.14,80.01 75.14,76.07 | 75.14,76.07 75.14,50.67 TP05M.P$1 | D01S.C 75.11,76.1 75.14,76.07 | U01M.33 63.62,37.04 63.84,36.83 74.5,36.83 74.76,37.08 v74.76,37.85
  Bottom 0.254: TP05M.P$1 75.39,38.48 v74.76,37.85
SMPS_CTRL  (via drill 0.3)  (1 unrouted)
  Top 0.254: U01M.51 60.67,48.63 v60.15,49.15 | TP1.P$1 19.24,58.93 R12B.1
  Top 0.305: v27.39,58.93 25.23,58.93 | 19.37,58.79 arc-90 R12B.1
  Top 0.813: R12B.1 17.25,58.97 Q01B.1
  Bottom 0.254: 60.66,47.62 60.66,48.64 v60.15,49.15 59.26,49.15 57.61,47.5 28.78,47.5 27.26,49.02 27.26,58.8 v27.39,58.93
SPI_MISO  (via drill 0.3)
  Top 0.254: J01S.7 78.85,80.67 77.42,79.25 | 77.42,54.23 TP03M.P$1 | 78.05,38.98 v78.19,39.12 77.93,38.86 72.85,38.86 72.09,38.1 65.49,38.1 65.36,38.23 65.36,38.61 64.99,38.98 U01M.35 | 77.42,79.25 77.42,54.23 | 77.42,79.25 77.42,54.23
  Bottom 0.254: TP03M.P$1 77.93,39.37 v78.19,39.12
SPI_MOSI  (via drill 0.3)
  Top 0.254: J01S.3 74.45,82.35 75.9,80.9 75.9,51.82 TP02M.P$1 | v76.15,39.88 75.77,39.5 72.6,39.5 71.84,38.73 66.12,38.73 65.36,39.5 63.64,39.5 U01M.36
  Bottom 0.254: TP02M.P$1 76.15,50.93 76.41,50.67 76.41,49.66 76.28,49.53 76.28,40.01 v76.15,39.88
SPI_SCK  (via drill 0.3)
  Top 0.254: 76.65,69.85 J01S.5 76.65,81.67 v76.66,81.66 | 76.65,69.85 76.65,69.35 76.66,69.34 | 76.66,52.96 TP04M.P$1 | R01S.2 65.77,82.27 v65.74,82.3 | U01M.34 64.6,38.48 64.72,38.35 64.72,37.72 64.98,37.47 72.72,37.47 v73.11,37.85 | 76.65,52.97 76.66,52.96 | 76.66,52.96 76.66,69.84 76.65,69.85
  Bottom 0.254: v65.74,82.3 76.03,82.3 v76.66,81.66 | v73.11,37.85 73.23,37.85 74.25,36.83 75.77,36.83 77.04,38.1 77.04,49.4 77.17,49.53 77.17,52.45 TP04M.P$1
SWD_CLK
  Top 0.254: U01M.49 61.67,48.38 61.93,48.64 66.5,48.64 68.28,46.86 71.88,46.86 72.39,47.37 J1.4
SWD_IO
  Top 0.254: U01M.46 64.75,44.48 65.36,45.09 73.28,45.09 73.66,45.47 J1.2
SWO
  Top 0.254: U01M.55 58.67,47.58 58.63,47.62 58.63,49.15 59.52,50.04 67.82,50.04 69.13,48.73 70.15,48.73 70.49,48.39 J1.6
U1CE2
  Top 0.254: J02S.30 46.51,13.54 52.15,19.18 R05D.2
U2CKV
  Top 0.254: J02S.38 50.53,10.7 52.15,12.32 R10D.1
U2SPV  (via drill 0.3)
  Top 0.254: R11D.1 55.14,17.59 54.82,17.91 52.53,17.91 52.28,17.65 v52.28,17.02
  Top 0.305: J02S.37 48.6,5.2 48.72,5.08 50.5,5.08 50.75,5.33 50.75,6.1 51.26,6.6 v51.64,6.6
  Bottom 0.254: v51.64,6.6 51.64,15.37 52.28,16 v52.28,17.02
USB_DISC  (1 unrouted)
  Top 0.203: TP06M.P$1 56.72,62.99 56.72,62.61
  Top 0.254: R11M.2 59.53,58.1 Q2.1 57.04,58.1 56.72,58.42 56.72,59.69 56.72,59.73 | 57.64,62.61 56.72,62.61 56.72,60.45 56.72,59.73 | U01M.57 57.67,50.35 58.93,51.61 58.93,56.13 58.06,57 55.52,57 54.61,57.91 54.61,59.27 55.06,59.73 56.72,59.73
VCOM
  Top 0.254: C17B.2 19.62,15.28 J11B.1
  Top 0.305: J02S.22 44.11,9.81 43.73,9.43 33.06,9.43 29.54,12.95 23.64,12.95 J11B.1
  Top 0.406: C17B.2 16.91,14.61 16.47,14.17 U06B.7 U06B.6
VDDA
  Top 0.254: C05M.1 C06M.1
VIN  (1 unrouted)
  Top 0.254: U03B.8 15.01,47.71 C09B.2 | Q01B.3 15.05,56.91 15.45,56.52
  Top 0.61: Q02B.2 22.59,56.44 R25B.2
  Top 0.813: 20.53,56.52 15.45,56.52 | 15.05,52.07 Q01B.3 J06B.1 | 15.05,52.07 C09B.2 | L02B.P$1 14.92,51.94 15.05,52.07
VUSB  (via drill 0.8 pad 1.68)  (2 unrouted)
  Top 0.203: J2.1 20.81,84.98 22.31,83.48 J01B.1
  Top 0.254: 8.24,85.69 8.24,85.82 U1.4
  Top 0.305: 12.65,84.84 12.65,84.51 R20B.1
  Top 0.406: 8.24,85.69 11.8,85.69 12.65,84.84 | U1.4 8.18,86.71 8.34,86.87 C19B.2
  Top 1.016: v15.19,82.8 15.19,83.06 13.8,84.45 12.6,84.45 R20B.1
  Bottom 0.254: 22.18,80.77 22.22,80.77
  Bottom 0.813: 22.18,80.77 17.1,80.77 17.1,80.9 v15.19,82.8
  pour Top (no thermals): 21.9,77.15 21.9,75.95 21.3,75.95 21.3,77.15
  pour Top (isolate 0.254): 21.3,77 21.9,77 21.9,78 24.8,80.9 24.8,85.7 20.8,85.7 20.8,78 21.3,77.5

## Text on the board
tNames: +5V | VIN | + | BM_OUT | - | CD | CHG | PWR | Designed in Singapore 07/15 / Eink display v0.2.0 / Apache License 2.0 / @kennethlimcp | RESET | MRST | +3V3 | MODE | GND | 3V3 | SPI | JRST | TDO | TDI | JTAG | TCK | CL | TMS | LE | OE | SHR | D0 | FTDI | D1 | -20V | +22V | D3 | D6 | D2 | D7 | E_VDD | SPH | GND / NIL / +3V3 / MCU_RX / MCU_TX | GND / NIL / +3V3 / MCU_RX / MCU_TX | D4 | D5 | RL | SPV | GMODE | +15V | -15V | VBORD | CKV | VCOM | SG / 50
bNames: SG / 50
bValues: G | G